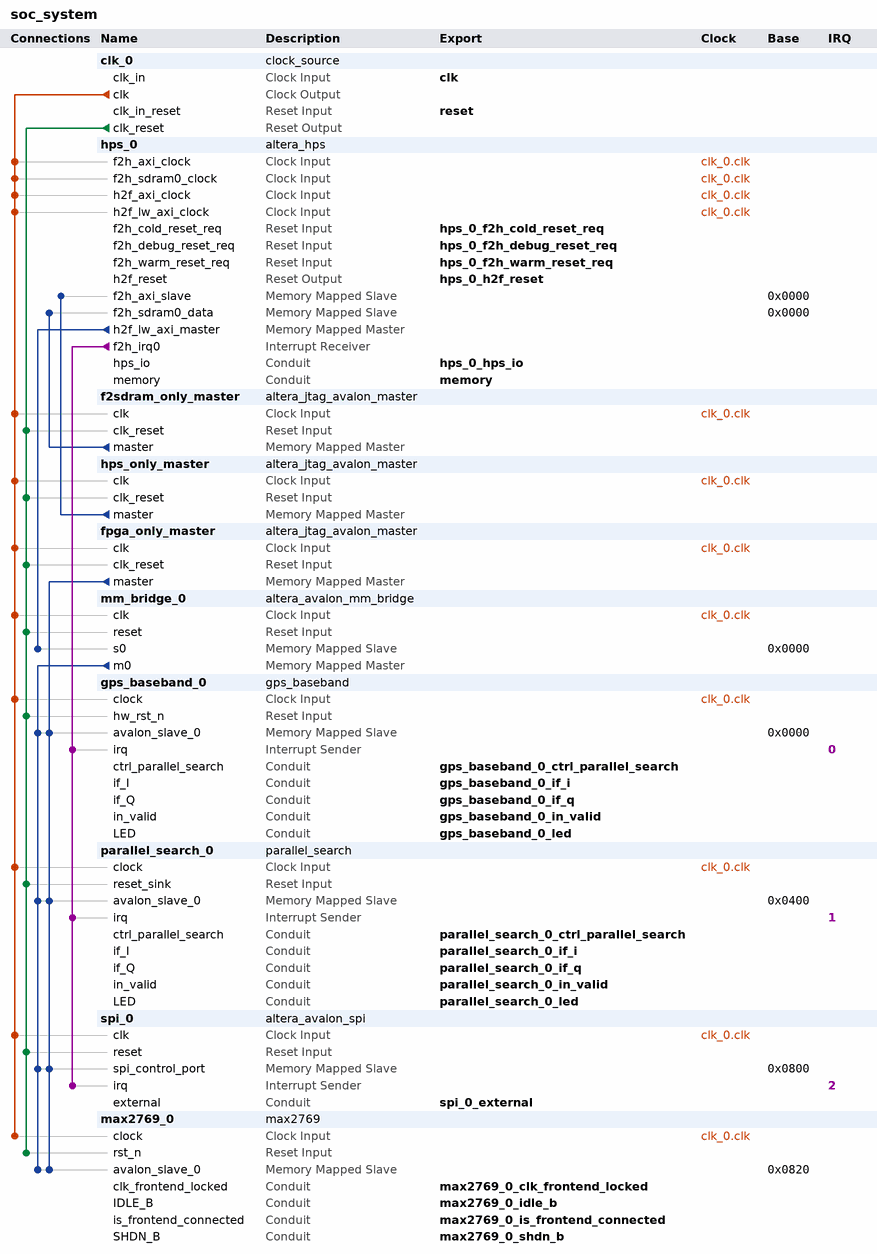
[diagram p0: system contents]
# Platform Designer (Qsys) system soc_system, Cyclone V 5CSEBA6U23I7
# Parameters at their usual value, and those the tool derives, are not listed.
package require -exact qsys 25.1
create_system soc_system
set_project_property DEVICE_FAMILY {Cyclone V}
set_project_property DEVICE 5CSEBA6U23I7

add_instance clk_0 clock_source 25.1
set_instance_parameter_value clk_0 clockFrequency 50000000

add_instance hps_0 altera_hps 25.1
set_instance_parameter_value hps_0 EMAC1_Mode N/A
set_instance_parameter_value hps_0 EMAC1_PinMuxing Unused
set_instance_parameter_value hps_0 F2SCLK_COLDRST_Enable true
set_instance_parameter_value hps_0 F2SCLK_DBGRST_Enable true
set_instance_parameter_value hps_0 F2SCLK_WARMRST_Enable true
set_instance_parameter_value hps_0 F2SDRAM_Type {Avalon-MM Bidirectional}
set_instance_parameter_value hps_0 F2SDRAM_Width 256
set_instance_parameter_value hps_0 F2SINTERRUPT_Enable true
set_instance_parameter_value hps_0 F2S_Width 2
set_instance_parameter_value hps_0 FPGA_PERIPHERAL_OUTPUT_CLOCK_FREQ_EMAC0_GTX_CLK 100
set_instance_parameter_value hps_0 FPGA_PERIPHERAL_OUTPUT_CLOCK_FREQ_EMAC0_MD_CLK 100.0
set_instance_parameter_value hps_0 FPGA_PERIPHERAL_OUTPUT_CLOCK_FREQ_EMAC1_GTX_CLK 100
set_instance_parameter_value hps_0 FPGA_PERIPHERAL_OUTPUT_CLOCK_FREQ_EMAC1_MD_CLK 100.0
set_instance_parameter_value hps_0 HPS_PROTOCOL DDR3
set_instance_parameter_value hps_0 I2C0_Mode N/A
set_instance_parameter_value hps_0 I2C0_PinMuxing Unused
set_instance_parameter_value hps_0 I2C1_Mode N/A
set_instance_parameter_value hps_0 I2C1_PinMuxing Unused
set_instance_parameter_value hps_0 LWH2F_Enable true
set_instance_parameter_value hps_0 MEM_BANKADDR_WIDTH 3
set_instance_parameter_value hps_0 MEM_CLK_FREQ 400.0
set_instance_parameter_value hps_0 MEM_COL_ADDR_WIDTH 10
set_instance_parameter_value hps_0 MEM_DQ_WIDTH 32
set_instance_parameter_value hps_0 MEM_DRV_STR RZQ/6
set_instance_parameter_value hps_0 MEM_ROW_ADDR_WIDTH 15
set_instance_parameter_value hps_0 MEM_RTT_NOM RZQ/6
set_instance_parameter_value hps_0 MEM_RTT_WR {Dynamic ODT off}
set_instance_parameter_value hps_0 MEM_TCL 7
set_instance_parameter_value hps_0 MEM_TFAW_NS 37.5
set_instance_parameter_value hps_0 MEM_TRAS_NS 35.0
set_instance_parameter_value hps_0 MEM_TRCD_NS 13.75
set_instance_parameter_value hps_0 MEM_TRFC_NS 300.0
set_instance_parameter_value hps_0 MEM_TRP_NS 13.75
set_instance_parameter_value hps_0 MEM_VENDOR Other
set_instance_parameter_value hps_0 MEM_WTCL 7
set_instance_parameter_value hps_0 QSPI_Mode N/A
set_instance_parameter_value hps_0 QSPI_PinMuxing Unused
set_instance_parameter_value hps_0 REF_CLK_FREQ 25.0
set_instance_parameter_value hps_0 S2FCLK_USER2CLK 4
set_instance_parameter_value hps_0 S2F_Width 2
set_instance_parameter_value hps_0 SDIO_Mode N/A
set_instance_parameter_value hps_0 SDIO_PinMuxing Unused
set_instance_parameter_value hps_0 SPIM1_Mode N/A
set_instance_parameter_value hps_0 SPIM1_PinMuxing Unused
set_instance_parameter_value hps_0 STM_Enable false
set_instance_parameter_value hps_0 TIMING_BOARD_AC_SKEW 0.02
set_instance_parameter_value hps_0 TIMING_BOARD_AC_TO_CK_SKEW 0.0
set_instance_parameter_value hps_0 TIMING_BOARD_DQ_TO_DQS_SKEW 0.0
set_instance_parameter_value hps_0 TIMING_BOARD_MAX_CK_DELAY 0.6
set_instance_parameter_value hps_0 TIMING_BOARD_MAX_DQS_DELAY 0.6
set_instance_parameter_value hps_0 TIMING_BOARD_SKEW_BETWEEN_DQS 0.02
set_instance_parameter_value hps_0 TIMING_BOARD_SKEW_CKDQS_DIMM_MAX 0.01
set_instance_parameter_value hps_0 TIMING_BOARD_SKEW_CKDQS_DIMM_MIN -0.01
set_instance_parameter_value hps_0 TIMING_BOARD_SKEW_WITHIN_DQS 0.02
set_instance_parameter_value hps_0 TIMING_TDH 125
set_instance_parameter_value hps_0 TIMING_TDQSCK 400
set_instance_parameter_value hps_0 TIMING_TDQSQ 120
set_instance_parameter_value hps_0 TIMING_TDS 50
set_instance_parameter_value hps_0 TIMING_TIH 250
set_instance_parameter_value hps_0 TIMING_TIS 175
set_instance_parameter_value hps_0 TIMING_TQSH 0.38
set_instance_parameter_value hps_0 UART0_Mode {No Flow Control}
set_instance_parameter_value hps_0 UART0_PinMuxing {HPS I/O Set 0}
set_instance_parameter_value hps_0 USB1_Mode N/A
set_instance_parameter_value hps_0 USB1_PinMuxing Unused
set_instance_parameter_value hps_0 desired_cfg_clk_mhz 100.0
set_instance_parameter_value hps_0 desired_qspi_clk_mhz 370.0

add_instance f2sdram_only_master altera_jtag_avalon_master 25.1

add_instance hps_only_master altera_jtag_avalon_master 25.1

add_instance fpga_only_master altera_jtag_avalon_master 25.1

add_instance mm_bridge_0 altera_avalon_mm_bridge 25.1
set_instance_parameter_value mm_bridge_0 ADDRESS_UNITS SYMBOLS
set_instance_parameter_value mm_bridge_0 ADDRESS_WIDTH 10
set_instance_parameter_value mm_bridge_0 DATA_WIDTH 32
set_instance_parameter_value mm_bridge_0 MAX_PENDING_RESPONSES 4
set_instance_parameter_value mm_bridge_0 USE_AUTO_ADDRESS_WIDTH 1

add_instance gps_baseband_0 gps_baseband 1.0
set_instance_parameter_value gps_baseband_0 num_channel 13

add_instance parallel_search_0 parallel_search 1.0

add_instance spi_0 altera_avalon_spi 25.1
set_instance_parameter_value spi_0 clockPolarity 0
set_instance_parameter_value spi_0 dataWidth 32
set_instance_parameter_value spi_0 masterSPI true
set_instance_parameter_value spi_0 numberOfSlaves 1
set_instance_parameter_value spi_0 targetClockRate 50000

add_instance max2769_0 max2769 1.0

# connections
add_connection clk_0.clk f2sdram_only_master.clk clock
add_connection clk_0.clk fpga_only_master.clk clock
add_connection clk_0.clk gps_baseband_0.clock clock
add_connection clk_0.clk hps_0.f2h_axi_clock clock
add_connection clk_0.clk hps_0.f2h_sdram0_clock clock
add_connection clk_0.clk hps_0.h2f_axi_clock clock
add_connection clk_0.clk hps_0.h2f_lw_axi_clock clock
add_connection clk_0.clk hps_only_master.clk clock
add_connection clk_0.clk max2769_0.clock clock
add_connection clk_0.clk mm_bridge_0.clk clock
add_connection clk_0.clk parallel_search_0.clock clock
add_connection clk_0.clk spi_0.clk clock
add_connection clk_0.clk_reset f2sdram_only_master.clk_reset reset
add_connection clk_0.clk_reset fpga_only_master.clk_reset reset
add_connection clk_0.clk_reset gps_baseband_0.hw_rst_n reset
add_connection clk_0.clk_reset hps_only_master.clk_reset reset
add_connection clk_0.clk_reset max2769_0.rst_n reset
add_connection clk_0.clk_reset mm_bridge_0.reset reset
add_connection clk_0.clk_reset parallel_search_0.reset_sink reset
add_connection clk_0.clk_reset spi_0.reset reset
add_connection f2sdram_only_master.master hps_0.f2h_sdram0_data avalon
set_connection_parameter_value f2sdram_only_master.master/hps_0.f2h_sdram0_data baseAddress 0x0000
add_connection fpga_only_master.master gps_baseband_0.avalon_slave_0 avalon
set_connection_parameter_value fpga_only_master.master/gps_baseband_0.avalon_slave_0 baseAddress 0x0000
add_connection fpga_only_master.master max2769_0.avalon_slave_0 avalon
set_connection_parameter_value fpga_only_master.master/max2769_0.avalon_slave_0 baseAddress 0x0820
add_connection fpga_only_master.master parallel_search_0.avalon_slave_0 avalon
set_connection_parameter_value fpga_only_master.master/parallel_search_0.avalon_slave_0 baseAddress 0x0400
add_connection fpga_only_master.master spi_0.spi_control_port avalon
set_connection_parameter_value fpga_only_master.master/spi_0.spi_control_port baseAddress 0x0800
add_connection hps_0.h2f_lw_axi_master mm_bridge_0.s0 avalon
set_connection_parameter_value hps_0.h2f_lw_axi_master/mm_bridge_0.s0 baseAddress 0x0000
add_connection hps_only_master.master hps_0.f2h_axi_slave avalon
set_connection_parameter_value hps_only_master.master/hps_0.f2h_axi_slave baseAddress 0x0000
add_connection mm_bridge_0.m0 gps_baseband_0.avalon_slave_0 avalon
set_connection_parameter_value mm_bridge_0.m0/gps_baseband_0.avalon_slave_0 baseAddress 0x0000
add_connection mm_bridge_0.m0 max2769_0.avalon_slave_0 avalon
set_connection_parameter_value mm_bridge_0.m0/max2769_0.avalon_slave_0 baseAddress 0x0820
add_connection mm_bridge_0.m0 parallel_search_0.avalon_slave_0 avalon
set_connection_parameter_value mm_bridge_0.m0/parallel_search_0.avalon_slave_0 baseAddress 0x0400
add_connection mm_bridge_0.m0 spi_0.spi_control_port avalon
set_connection_parameter_value mm_bridge_0.m0/spi_0.spi_control_port baseAddress 0x0800
add_connection hps_0.f2h_irq0 gps_baseband_0.irq interrupt
set_connection_parameter_value hps_0.f2h_irq0/gps_baseband_0.irq irqNumber 0
add_connection hps_0.f2h_irq0 parallel_search_0.irq interrupt
set_connection_parameter_value hps_0.f2h_irq0/parallel_search_0.irq irqNumber 1
add_connection hps_0.f2h_irq0 spi_0.irq interrupt
set_connection_parameter_value hps_0.f2h_irq0/spi_0.irq irqNumber 2

# exported interfaces
add_interface clk clock sink
set_interface_property clk EXPORT_OF clk_0.clk_in
add_interface gps_baseband_0_ctrl_parallel_search conduit end
set_interface_property gps_baseband_0_ctrl_parallel_search EXPORT_OF gps_baseband_0.ctrl_parallel_search
add_interface gps_baseband_0_if_i conduit end
set_interface_property gps_baseband_0_if_i EXPORT_OF gps_baseband_0.if_I
add_interface gps_baseband_0_if_q conduit end
set_interface_property gps_baseband_0_if_q EXPORT_OF gps_baseband_0.if_Q
add_interface gps_baseband_0_in_valid conduit end
set_interface_property gps_baseband_0_in_valid EXPORT_OF gps_baseband_0.in_valid
add_interface gps_baseband_0_led conduit end
set_interface_property gps_baseband_0_led EXPORT_OF gps_baseband_0.LED
add_interface hps_0_f2h_cold_reset_req reset sink
set_interface_property hps_0_f2h_cold_reset_req EXPORT_OF hps_0.f2h_cold_reset_req
add_interface hps_0_f2h_debug_reset_req reset sink
set_interface_property hps_0_f2h_debug_reset_req EXPORT_OF hps_0.f2h_debug_reset_req
add_interface hps_0_f2h_warm_reset_req reset sink
set_interface_property hps_0_f2h_warm_reset_req EXPORT_OF hps_0.f2h_warm_reset_req
add_interface hps_0_h2f_reset reset source
set_interface_property hps_0_h2f_reset EXPORT_OF hps_0.h2f_reset
add_interface hps_0_hps_io conduit end
set_interface_property hps_0_hps_io EXPORT_OF hps_0.hps_io
add_interface max2769_0_clk_frontend_locked conduit end
set_interface_property max2769_0_clk_frontend_locked EXPORT_OF max2769_0.clk_frontend_locked
add_interface max2769_0_idle_b conduit end
set_interface_property max2769_0_idle_b EXPORT_OF max2769_0.IDLE_B
add_interface max2769_0_is_frontend_connected conduit end
set_interface_property max2769_0_is_frontend_connected EXPORT_OF max2769_0.is_frontend_connected
add_interface max2769_0_shdn_b conduit end
set_interface_property max2769_0_shdn_b EXPORT_OF max2769_0.SHDN_B
add_interface memory conduit end
set_interface_property memory EXPORT_OF hps_0.memory
add_interface parallel_search_0_ctrl_parallel_search conduit end
set_interface_property parallel_search_0_ctrl_parallel_search EXPORT_OF parallel_search_0.ctrl_parallel_search
add_interface parallel_search_0_if_i conduit end
set_interface_property parallel_search_0_if_i EXPORT_OF parallel_search_0.if_I
add_interface parallel_search_0_if_q conduit end
set_interface_property parallel_search_0_if_q EXPORT_OF parallel_search_0.if_Q
add_interface parallel_search_0_in_valid conduit end
set_interface_property parallel_search_0_in_valid EXPORT_OF parallel_search_0.in_valid
add_interface parallel_search_0_led conduit end
set_interface_property parallel_search_0_led EXPORT_OF parallel_search_0.LED
add_interface reset reset sink
set_interface_property reset EXPORT_OF clk_0.clk_in_reset
add_interface spi_0_external conduit end
set_interface_property spi_0_external EXPORT_OF spi_0.external

set_interconnect_requirement {$system} qsys_mm.clockCrossingAdapter HANDSHAKE
set_interconnect_requirement {$system} qsys_mm.maxAdditionalLatency 1

save_system soc_system.qsys
